# Altium schematic sheet Video.SchDoc
size A4
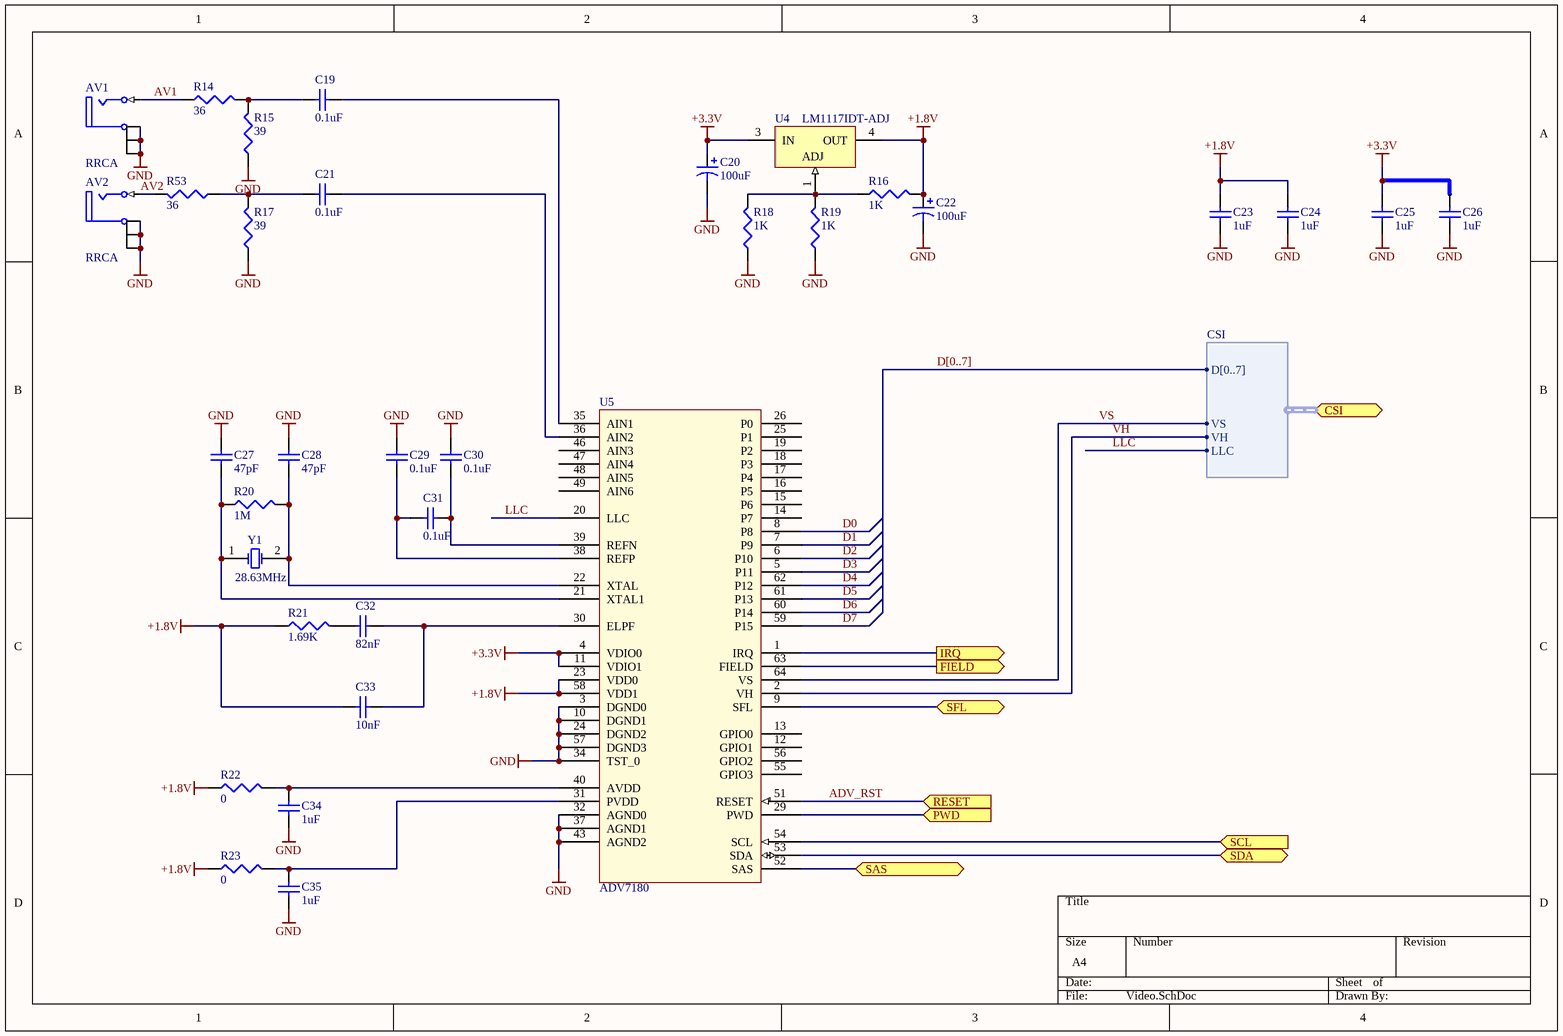
[diagram p0: Video.SchDoc]

## Parts
AV1  RRCA  [RCA-R]
AV2  RRCA  [RCA-R]
C19  0.1uF  [1608[0603]]
C20  100uF  [6032]
C21  0.1uF  [1608[0603]]
C22  100uF  [6032]
C23  1uF  [1608[0603]]
C24  1uF  [1608[0603]]
C25  1uF  [1608[0603]]
C26  1uF  [1608[0603]]
C27  47pF  [1608[0603]]
C28  47pF  [1608[0603]]
C29  0.1uF  [1608[0603]]
C30  0.1uF  [1608[0603]]
C31  0.1uF  [1608[0603]]
C32  82nF  [1608[0603]]
C33  10nF  [1608[0603]]
C34  1uF  [1608[0603]]
C35  1uF  [1608[0603]]
R14  36  [R2012[0805]]
R15  39  [R2012[0805]]
R16  1K  [R2012[0805]]
R17  39  [R2012[0805]]
R18  1K  [R2012[0805]]
R19  1K  [R2012[0805]]
R20  1M  [2012[0805]]
R21  1.69K  [R1608[0603]]
R22  0  [R1608[0603]]
R23  0  [R1608[0603]]
R53  36  [R2012[0805]]
U4  LM1117IDT-ADJ  [TD03B_N]
U5  ADV7180  [SQFP10X10-64]
Y1  28.63MHz  [HC49/4H_SMX]

## Ports
CSI (harness CSI), FIELD (out), IRQ (out), PWD (in), RESET (in), SAS, SCL (in), SDA (bidir), SFL (bidir)

## Harnesses
CSI: D[0..7], VS, VH, LLC

## Nets
+1.8V: C22.1 C23.2 C24.2 C33.1 R16.2 R21.1 R22.1 R23.1 U4.4(OUT) U5.23(VDD0) U5.58(VDD1)
+3.3V: C20.1 C25.2 C26.2 U4.3(IN) U5.4(VDIO0) U5.11(VDIO1)
GND: AV1.G1(Ground) AV1.G2(Ground) AV1.G3(Ground) AV2.G1(Ground) AV2.G2(Ground) AV2.G3(Ground) C20.2 C22.2 C23.1 C24.1 C25.1 C26.1 C27.1 C28.1 C29.2 C30.2 C34.2 C35.2 R15.1 R17.1 R18.1 R19.1 U5.3(DGND0) U5.10(DGND1) U5.24(DGND2) U5.32(AGND0) U5.34(TST_0) U5.37(AGND1) U5.43(AGND2) U5.57(DGND3)
ADV_RST: U5.51(RESET) ; port RESET
AV1: AV1.SIGNAL(Signal) R14.1
AV2: AV2.SIGNAL(Signal) R53.2
D0: U5.8(P8)
D1: U5.7(P9)
D2: U5.6(P10)
D3: U5.5(P11)
D4: U5.62(P12)
D5: U5.61(P13)
D6: U5.60(P14)
D7: U5.59(P15)
FIELD: U5.63(FIELD) ; port FIELD
IRQ: U5.1(IRQ) ; port IRQ
LLC: U5.20(LLC) ; port CSI.LLC
PWD: U5.29(PWD) ; port PWD
SAS: U5.52(SAS) ; port SAS
SCL: U5.54(SCL) ; port SCL
SDA: U5.53(SDA) ; port SDA
SFL: U5.9(SFL) ; port SFL
VH: U5.2(VH) ; port CSI.VH
VS: U5.64(VS) ; port CSI.VS
NetC19_1: C19.1 U5.35(AIN1)
NetC19_2: C19.2 R14.2 R15.2
NetC21_1: C21.1 U5.36(AIN2)
NetC21_2: C21.2 R17.2 R53.1
NetC27_2: C27.2 R20.1 U5.21(XTAL1) Y1.1(OSC1)
NetC28_2: C28.2 R20.2 U5.22(XTAL) Y1.2(OSC2)
NetC29_1: C29.1 C31.2 U5.38(REFP)
NetC30_1: C30.1 C31.1 U5.39(REFN)
NetC32_1: C32.1 R21.2
NetC32_2: C32.2 C33.2 U5.30(ELPF)
NetC34_1: C34.1 R22.2 U5.40(AVDD)
NetC35_1: C35.1 R23.2 U5.31(PVDD)
NetR16_1: R16.1 R18.2 R19.2 U4.1(ADJ)

Not connected (* = marked no-connect by the designer): U5 12(GPIO1) 13(GPIO0) 14(P7) 15(P6) 16(P5) 17(P4) 18(P3) 19(P2) 25(P1) 26(P0) 46(AIN3) 47(AIN4) 48(AIN5) 49(AIN6) 55(GPIO3) 56(GPIO2)

## Buses and harness runs
bus D[0..7]

## Library data of the parts
AV1 AV2 = RCA: RCA Right Angle, Through hole, PCB mount
C19 C21 C23-C35 = C0603: Ceramic Chip Capacitor - Standard; Note: Footprint corresponds to dimensions for bulk cassette packaging. This case size has tightened tolerances.; Published: 17-Jul-2002; LatestRevisionDate: 19-Mar-2004; LatestRevisionNote: Silkscreen size reduced.; DatasheetDocument: Mar-2001; PackageDocument: Mar-2001; PackageReference: 0603; Publisher: Altium Limited; Code_JEITA: 0603; Code_IPC: 1608 [0603]; ComponentLink1Description: Manufacturer Link; ComponentLink1URL: http://www.kemet.com/; ComponentLink2Description: Datasheet; ComponentLink2URL: http://www.kemet.com/kemet/web/homepage/kechome.nsf/vapubfilesname/F3102TA.pdf/$file/F3102TA.pdf
  C19 C21 C29-C31: Value: 0.1uF
  C23-C26 C34 C35: Value: 1uF
  C27 C28: Value: 47pF
  C32: Value: 82nF
  C33: Value: 10nF
C20 C22 = 893D225X0025C2: Tantamount Built-In-Fuse Miniature, Molded-Case Solid Tantalum Chip Capacitor: 2.2uF, 20% Tolerance, 25 WVDC @ +85°C, Surge = 32V; Note: See Data Sheet for full range of components; Published: 19-Mar-2004; DatasheetDocument: 04-Feb-2003; PackageReference: 6032; Publisher: Altium Limited; Code_JEITA: 6032; ComponentLink1Description: Manufacturer Link; ComponentLink1URL: http://www.vishay.com/; ComponentLink2Description: Datasheet; ComponentLink2URL: http://www.vishay.com/docs/40008/893d.pdf; Value: 100uF
R14-R19 R53 = R0805: Published: 8-Jun-2000; LatestRevisionDate: 29-May-2009; LatestRevisionNote: IPC-7351 Footprint Added.; PackageReference: J1-0603; Publisher: Altium Limited; PackageDescription: Chip Resistor
  R14 R53: Value: 36
  R15 R17: Value: 39
  R16 R18 R19: Value: 1K
R20 = Res3: Resistor; Published: 8-Jun-2000; LatestRevisionDate: 29-May-2009; LatestRevisionNote: IPC-7351 Footprint Added.; PackageReference: J1-0603; Publisher: Altium Limited; PackageDescription: Chip Resistor; Value: 1M
R21-R23 = R0603: Published: 8-Jun-2000; LatestRevisionDate: 29-May-2009; LatestRevisionNote: IPC-7351 Footprint Added.; PackageReference: J1-0603; Publisher: Altium Limited; PackageDescription: Chip Resistor
  R21: Value: 1.69K
  R22 R23: Value: 0
U4 = LM1117IDT-ADJ: 800mA Low-Dropout Linear Regulator, 3-pin TO-252; Manufacturer: National Semiconductor; PackageTopMarking: NSUZXYTT*LM1117*IDT-ADJ; PowerWise: N; CompType: LDO IC; High-Reliability: Y; DatasheetVersion: Apr-2006; PackageVersion: revD, Feb-2009; PackageReference: TD03B; PackageDescription: TO252, Molded, Jedec, 6.8 x 6.10 x 2.30mm Body, 3 Lead, 2.28mm Pitch, Surface Mount; PartNumber: LM1117IDT-ADJ; RoHS: N; PinCount: 3; Code_JEDEC: TO-252-AA; ComponentLink1Description: Manufacturer URL; ComponentLink1URL: http://www.national.com/; ComponentLink2Description: LM1117 Datasheet; ComponentLink2URL: http://www.national.com/ds/LM/LM1117.pdf; ComponentLink3Description: LM1117 Web Page; ComponentLink3URL: http://www.national.com/pf/LM/LM1117.html; ComponentLink4Description: TD03B Package Page; ComponentLink4URL: http://www.national.com/packaging/folders/td03b.html
Y1 = XTAL: Crystal Oscillator; Published: 8-Jun-2000; LatestRevisionDate: 17-Jul-2002; LatestRevisionNote: Re-released for DXP Platform.; PackageReference: R38; Publisher: Altium Limited; PackageDescription: Crystal, Thru-Hole; 2 Leads; Body 3.1 x 8.2 mm (Dia.xH); Value: 28.63MHz